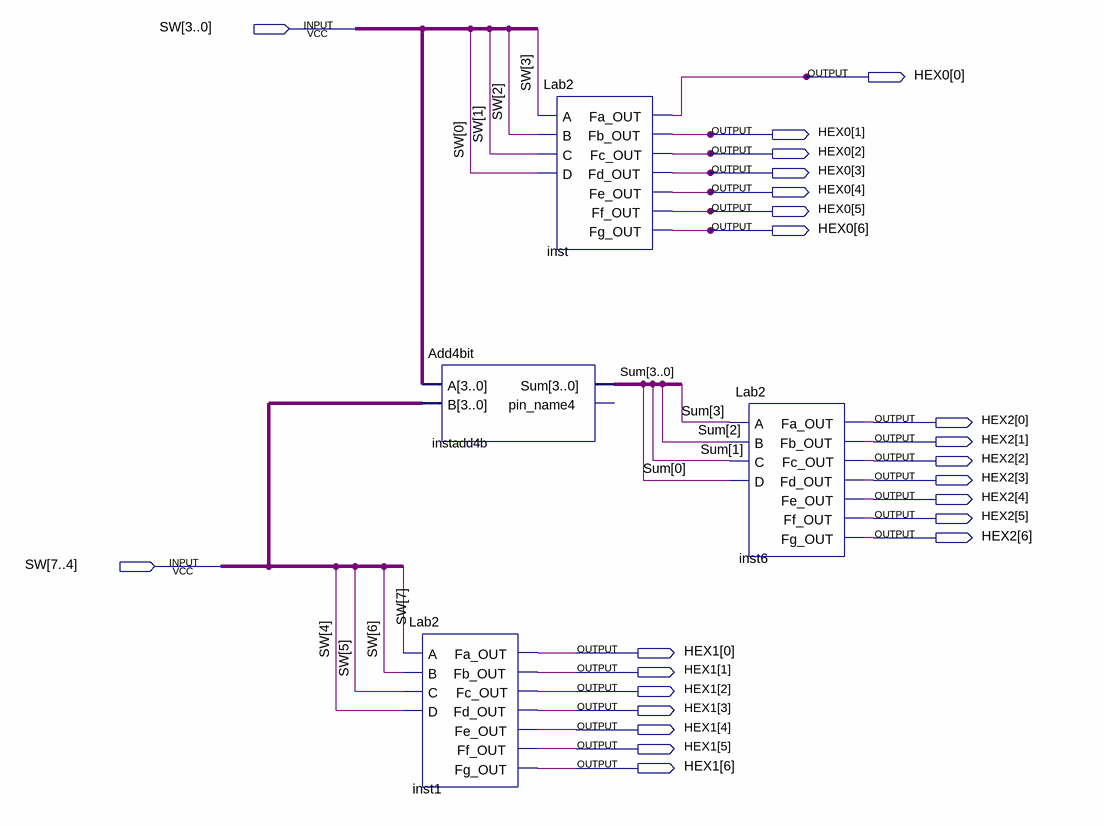
[diagram p0: schematic sheet]
// Quartus schematic TestAdder.bdf as structural Verilog: 4 symbols, 23 pins
module TestAdder (
  input  [7:0] SW,
  output [6:0] HEX0,
  output [6:0] HEX2,
  output [6:0] HEX1
);

  wire [3:0] Sum;

  Lab2 inst1 (
    .A(SW[7]), .B(SW[6]), .C(SW[5]), .D(SW[4]), .Fa_OUT(HEX1[0]), .Fb_OUT(HEX1[1]), .Fc_OUT(HEX1[2]),
    .Fd_OUT(HEX1[3]), .Fe_OUT(HEX1[4]), .Ff_OUT(HEX1[5]), .Fg_OUT(HEX1[6]));
  Add4bit instadd4b (.A(SW[3:0]), .B(SW[7:4]), .Sum(Sum));  // open: pin_name4
  Lab2 inst (
    .A(SW[3]), .B(SW[2]), .C(SW[1]), .D(SW[0]), .Fa_OUT(HEX0[0]), .Fb_OUT(HEX0[1]), .Fc_OUT(HEX0[2]),
    .Fd_OUT(HEX0[3]), .Fe_OUT(HEX0[4]), .Ff_OUT(HEX0[5]), .Fg_OUT(HEX0[6]));
  Lab2 inst6 (
    .A(Sum[3]), .B(Sum[2]), .C(Sum[1]), .D(Sum[0]), .Fa_OUT(HEX2[0]), .Fb_OUT(HEX2[1]), .Fc_OUT(HEX2[2]),
    .Fd_OUT(HEX2[3]), .Fe_OUT(HEX2[4]), .Ff_OUT(HEX2[5]), .Fg_OUT(HEX2[6]));
endmodule
